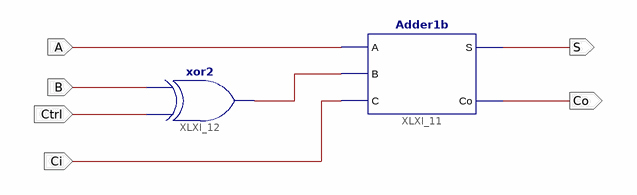
[diagram p0: schematic sheet 1]
// Xilinx ISE schematic AddSub1b.sch (kintex7) as structural Verilog: 2 symbols, 6 ports
module AddSub1b (
  input  A,
  input  Ci,
  input  B,
  input  Ctrl,
  output S,
  output Co
);

  wire XLXN_16;

  Adder1b XLXI_11 (.A(A), .B(XLXN_16), .C(Ci), .S(S), .Co(Co));
  xor XLXI_12 (XLXN_16, Ctrl, B);
endmodule
